# Altium schematic sheet power.SchDoc
size A4; SheetNumber: 2; SheetTotal: 5
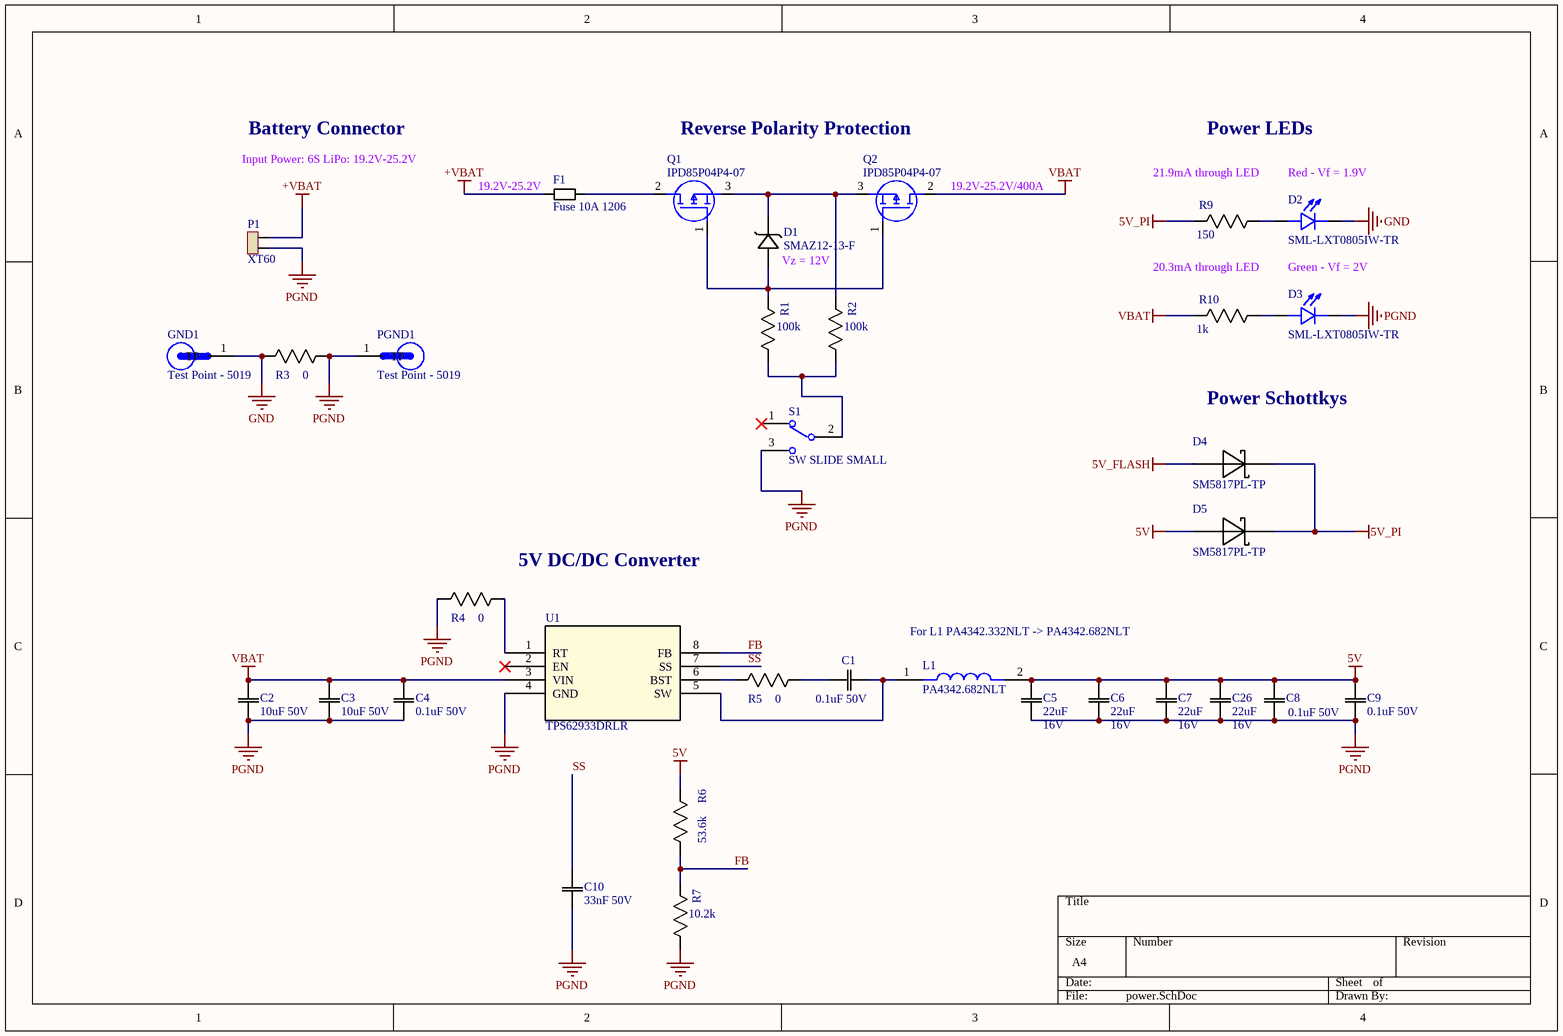
[diagram p0: power.SchDoc]

## Parts
C1  0.1uF 50V  [0805]
C2  10uF 50V  [0805]
C3  10uF 50V  [0805]
C4  0.1uF 50V  [0805]
C5  Rating: 16V  [0805]  (hidden comment: 22uF)
C6  Rating: 16V  [0805]  (hidden comment: 22uF)
C7  Rating: 16V  [0805]  (hidden comment: 22uF)
C8  0.1uF 50V  [0805]
C9  0.1uF 50V  [0805]
C10  33nF 50V  [0805]
C26  Rating: 16V  [0805]  (hidden comment: 22uF)
D1  SMAZ12-13-F  [SMA_DIO-L]
D2  SML-LXT0805IW-TR  [LEDC2012X120N]
D3  SML-LXT0805IW-TR  [LEDC2012X120N]
D4  SM5817PL-TP  [SOD-123]
D5  SM5817PL-TP  [SOD-123]
F1  Fuse 10A 1206  [1206]
GND1  Test Point - 5019  [TP380X203]
L1  PA4342.682NLT  [IND_PA4342.332NLT]
P1  XT60  [Amass_XT60PW-M]
PGND1  Test Point - 5019  [TP380X203]
Q1  IPD85P04P4-07  [DPAK (TO-252)]
Q2  IPD85P04P4-07  [DPAK (TO-252)]
R1  100k  [0805]
R2  100k  [0805]
R3  0  [0805]
R4  0  [0805]
R5  0  [0805]
R6  53.6k  [0805]
R7  10.2k  [0805]
R9  150  [0805]
R10  1k  [0805]
S1  SW SLIDE SMALL  [SW SLIDE SMALL]
U1  TPS62933DRLR  [SOT_33DRLR_TEX]

## Nets
5V: C5.2(C2) C6.2(C2) C7.2(C2) C8.2(C2) C9.2(C2) C26.2(C2) D5.A L1.2 R6.2(R2)
5V_FLASH: D4.A
5V_PI: D4.C(K) D5.C(K) R9.2(R2)
+VBAT: F1.1 P1.2
GND: D2.C GND1.1(TP) R3.2(R2)
PGND: C2.1(C1) C3.1(C1) C4.1(C1) C5.1(C1) C6.1(C1) C7.1(C1) C8.1(C1) C9.1(C1) C10.1(C1) C26.1(C1) D3.C P1.1 PGND1.1(TP) R3.1(R1) R4.2(R2) R7.1(R1) S1.3 U1.4(GND)
VBAT: C2.2(C2) C3.2(C2) C4.2(C2) Q2.2(D) R10.2(R2) U1.3(VIN)
FB: R6.1(R1) R7.2(R2) U1.8(FB)
SS: C10.2(C2) U1.7(SS)
NetC1_1: C1.1(C1) L1.1 U1.5(SW)
NetC1_2: C1.2(C2) R5.1(R1)
NetD1_1: D1.1 Q1.3(S) Q2.3(S) R2.2(R2)
NetD1_2: D1.2 Q1.1(G) Q2.1(G) R1.2(R2)
NetD2_A: D2.A R9.1(R1)
NetD3_A: D3.A R10.1(R1)
NetF1_2: F1.2 Q1.2(D)
NetR1_1: R1.1(R1) R2.1(R1) S1.2
NetR4_1: R4.1(R1) U1.1(RT)
NetR5_2: R5.2(R2) U1.6(BST)

Not connected (* = marked no-connect by the designer): S1 1*; U1 2(EN)*

## Notes on the sheet
- Input Power: 6S LiPo: 19.2V-25.2V
- Battery Connector
- Reverse Polarity Protection
- 21.9mA through LED
- Power LEDs
- Red - Vf = 1.9V
- (near F1) 19.2V-25.2V
- (near Q2) 19.2V-25.2V/400A
- (near D1) Vz = 12V
- 20.3mA through LED
- Green - Vf = 2V
- Power Schottkys
- (near R4) 5V DC/DC Converter
- For L1 PA4342.332NLT -> PA4342.682NLT

## Library data of the parts
C1 C4 C8 C9 = CAP 10uF 50V: Default Symbol for Capacitors; Manufacturer Part Number 1: GRM21BR61H106KE43L; Value: 10uF; Temperature Coefficient: X5R; Tolerance: 10%; Part Number: CAP 10uF 50V; Supplier 1: Digi-Key; Supplier Part Number 1: 490-18663-1-ND; Manufacturer Part Number 2: CL32B106KBJNNWE; Supplier 2: Digi-Key; Supplier Part Number 2: 1276-3388-1-ND; Rating: 50V
C2 C3 = CAP 10uF 50V: Default Symbol for Capacitors; Manufacturer Part Number 1: GRM21BR61H106KE43L; Temperature Coefficient: X5R; Tolerance: 10%; Part Number: CAP 10uF 50V; Supplier 1: Digi-Key; Supplier Part Number 1: 490-18663-1-ND; Manufacturer Part Number 2: CL32B106KBJNNWE; Supplier 2: Digi-Key; Supplier Part Number 2: 1276-3388-1-ND; Value: 10uF; Rating: 50V
C5-C7 C26 = CAP 22uF 16V: CAP CER 22UF 16V X5R 0805; Tolerance: 10%; Package: 0805; Temperature Coefficient: X5R; Operating Temperature: -55°C ~ 85°C; Value: 22uF; Part Number: CAP 22uF 16V
C10 = CAP 33nF 50V: Default Symbol for Capacitors; Tolerance: 5%; Part Number: CAP 33nF 50V; Value: 33nF; Rating: 50V
D1 = DIODE ZENER 12V 1W: Zener Diode 12 V 1 W ±5% Surface Mount SMA; Mfr_Name: Diodes Inc; Type: DEV; Copyright: Copyright (C) 2021 Ultra Librarian. All rights reserved.; Manufacturer_Part_Number: SMAZ12-13-F; Digi-Key_Part_Number_1: SMAZ12-FDICT-ND; Digi-Key_Part_Number_2: SMAZ12-FDIDKR-ND; Digi-Key_Part_Number_3: SMAZ12-FDITR-ND; RefDes: RefDes; Supplier 1: Digi-Key; Supplier 2: Newark; Supplier 3: Digi-Key; Supplier Part Number 1: SMAZ12-FDICT-ND; Supplier Part Number 2: 23T8541; Supplier Part Number 3: SMAZ12-FDICT-ND; Part Number: DIODE ZENER 12V 1W; Manufacturer Part Number 1: SMAZ12-13-F; Supplier URL 1: https://www.digikey.com/en/products/detail/SMAZ12-13-F/SMAZ12-FDICT-ND/725073?curr=usd&utm_campaign=buynow&utm_medium=aggregator&utm_source=octopart
D2 D3 = SML-LXT0805IW-TR: LED;Red;11mcd;0.061In.Dia.;SMD;100mA;2V Vf;635nm;140deg;SMD;White Diffused;5V Vr | Lumex SML-LXT0805IW-TR; MF: Lumex Opto/Components; SnapEDA_Link: https://www.snapeda.com/parts/SML-LXT0805IW-TR/Lumex+Opto%252FComponents+Inc./view-part/?ref=snap; Package: 0805 Lumex; Value: *; MP: SML-LXT0805IW-TR; Check_prices: https://www.snapeda.com/parts/SML-LXT0805IW-TR/Lumex+Opto%252FComponents+Inc./view-part/?ref=eda
D4 D5 = DIODE SCHOTTKY 20V 1A: Diode Schottky 20V 1A Surface Mount SOD-123FL; MF: Micro Commercial Co; ComponentLink1Description: digikey; ComponentLink1URL: https://www.digikey.ca/product-detail/en/on-semiconductor/MBR0540T1G/MBR0540T1GOSCT-ND/917967; Digikey: SM5817PL-TPMSCT-ND; Digikey Link: https://www.digikey.ca/product-detail/en/micro-commercial-co/SM5817PL-TP/SM5817PL-TPMSCT-ND/1793410; MP: SM5817PL-TP; Voltage Rating: 20V; Package: SOD-123; Current Rating: 1A; Part Number: DIODE SCHOTTKY 20V 1A; Supplier URL 1: https://www.digikey.ca/product-detail/en/on-semiconductor/MBR0540T1G/MBR0540T1GOSCT-ND/917967; Pin Count: 2
F1 = FUSE 10A 63V SLOW: FUSE 10A 32V AC 63V DC 1206; Response Time: Slow Blow; Rating: 10A; Voltage Rating - DC: 63V; Operating Temperature: -55°C ~ 90°C; Part Number: FUSE 10A 63V SLOW; Pin Count: 2
GND1 PGND1 = Test Point - 5019: PC Test Point, Miniature Phosphor Bronze, Silver Plating Surface Mount Mounting Type; MP: 5019; MF: Keystone Electronics; Value: *; Package: 2010 Keystone; Part Number: Test Point - 5019
L1 = PA4342.332NLT: FIXED IND 6.8UH 8.5A 23.3MOHM SM; MF: Pulse; Package: Nonstandard Pulse; Price: None; Check_prices: https://www.snapeda.com/parts/PA4342.332NLT/Pulse/view-part/?ref=eda; Value: *; SnapEDA_Link: https://www.snapeda.com/parts/PA4342.332NLT/Pulse/view-part/?ref=snap; MP: PA4342.332NLT; Availability: In Stock; Purchase-URL: https://pricing.snapeda.com/search/part/PA4342.332NLT/?ref=eda
P1 = XT60 Connector: XT60 CONNECTORS FEMALE PAIR; MF: SparkFun Electronics; MP: PRT-10474; Digikey: 1568-1816-ND; Digikey Link: https://www.digikey.ca/product-detail/en/sparkfun-electronics/PRT-10474/1568-1816-ND/8258064; Package: XT60; Price: 2.13000 CAD; Value: N/A; Supplier 1: Digi-Key; Supplier Part Number 1: 1568-1816-ND; Part Number: XT60 Connector; Supplier URL 1: https://www.digikey.ca/product-detail/en/sparkfun-electronics/PRT-10474/1568-1816-ND/8258064; Pin Count: 2
Q1 Q2 = MOSFET IPD85P04P4-07: P-Channel 40 V 85A (Tc) 88W (Tc) Surface Mount PG-TO252-3-313; Supplier 1: Digi-Key; Supplier 2: Mouser; Supplier 3: Digi-Key; Supplier Part Number 1: 448-IPD85P04P407ATMA1CT-ND; Supplier Part Number 2: 726-IPD85P04P4-07; Supplier Part Number 3: 448-IPD85P04P407ATMA1CT-ND; Part Number: MOSFET IPD85P04P4-07; Supplier URL 1: https://www.digikey.ca/en/products/detail/infineon-technologies/IPD85P04P407ATMA1/5960266
R1 R2 = RES 100k 1/8W - 1%: Default Resistor Symbol; Manufacturer Part Number 1: ERJ-H3GJ104V; Power (Watts): 0.125W; Tolerance: 1%; Package: 0805; Value: 100k; Part Number: RES 100k 1/8W - 1%; Supplier 1: Digi-Key; Supplier Part Number 1: 10-ERJ-H3GJ104VCT-ND; Supplier URL 1: https://www.digikey.ca/en/products/detail/panasonic-electronic-components/ERJ-H3GJ104V/13877854?s=N4IgTCBcDaIIwAYC0BRASgKSQCQMwHENEAWANQGEAVJAOQBEQBdAXyA
R3-R5 = RES 0 JUMPER 0603: Default Resistor Symbol; Power (Watts): 0.125W; Package: 0805; Tolerance: N/A; Value: 0; Part Number: RES 0 JUMPER 0603
R6 = RES 56.2k 1/10W: Default Resistor Symbol; Value: 1; Power (Watts): 0.125W; Tolerance: 5%; Package: 0805; Part Number: RES 56.2k 1/10W
R7 = RES 10.2k 1/8W: Default Resistor Symbol; Power (Watts): 0.125W; Tolerance: 5%; Package: 0805; Value: 10.2k; Part Number: RES 10.2k 1/8W
R9 = RES 150.0 1/8W: Default Resistor Symbol; Value: 1; Power (Watts): 0.125W; Tolerance: 5%; Package: 0805; Part Number: RES 150.0 1/8W
R10 = RES 1.1k 1/8W: Default Resistor Symbol; Value: 1; Power (Watts): 0.125W; Tolerance: 5%; Package: 0805; Part Number: RES 1.1k 1/8W
S1 = SW SLIDE SMALL: Slide Switch SPDT Surface Mount, Right Angle; Manufacturer Part Number 1: JS102011SAQN SPDT; MF: C&K; MP: JS102011SAQN; Availability: Unavailable; Price: None; SnapEDA_Link: https://www.snapeda.com/parts/JS102011SAQN/C%26K/view-part/214325/?ref=snap; Value: *; Package: None; Part Number: SW SLIDE SMALL; Supplier 1: Digi-key; Supplier Part Number 1: JS102011SAQN SPDT; Supplier URL 1: https://www.digikey.ca/en/products/detail/c-k/JS102011SAQN/1640095
U1 = XTPS62933DRLR: No Description Available; Mfr_Name: Texas Instruments; RefDes: RefDes; Type: Type